# Altium schematic sheet S1_Interface.SchDoc
size A3; SheetNumber: 1; SheetTotal: 2
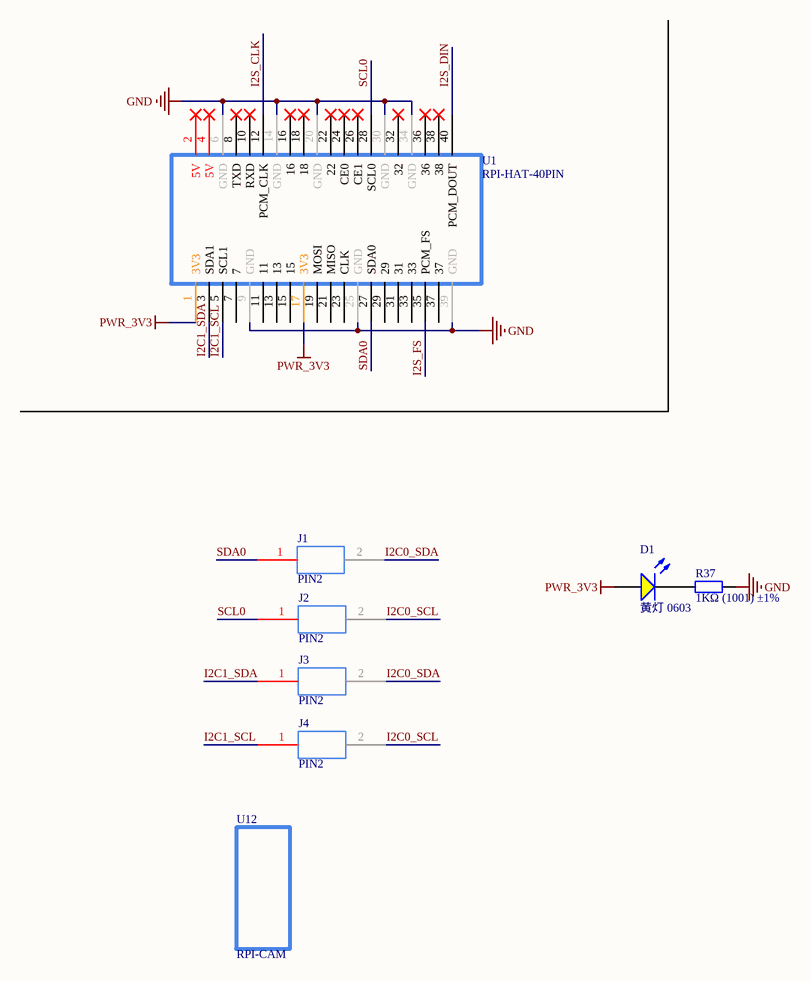
[diagram p0: S1_Interface.SchDoc]

## Parts
D1  黄灯 0603  [0603_LED_S1]
J1  PIN2  [PIN2]
J2  PIN2  [PIN2]
J3  PIN2  [PIN2]
J4  PIN2  [PIN2]
R37  1KΩ (1001) ±1%  [0603_R]
U1  RPI-HAT-40PIN  [RPI-HAT-40PIN]
U12  RPI-CAM  [RPI-CAM]

## Nets
GND: R37.2 U1.6(GND) U1.9(GND) U1.14(GND) U1.20(GND) U1.25(GND) U1.30(GND) U1.34(GND) U1.39(GND)
PWR_3V3: D1.A U1.1(3V3) U1.17(3V3)
I2C0_SCL: J2.2(GND) J4.2(GND)
I2C0_SDA: J1.2(GND) J3.2(GND)
I2C1_SCL: J4.1(VCC) U1.5(SCL1)
I2C1_SDA: J3.1(VCC) U1.3(SDA1)
I2S_CLK: U1.12(PCM_CLK)
I2S_DIN: U1.40(PCM_DOUT)
I2S_FS: U1.35(PCM_FS)
SCL0: J2.1(VCC) U1.28(SCL0)
SDA0: J1.1(VCC) U1.27(SDA0)
NetD1_K: D1.K R37.1

Not connected (* = marked no-connect by the designer): U1 2(5V)* 4(5V)* 7 8(TXD)* 10(RXD)* 11 13 15 16* 18* 19(MOSI) 21(MISO) 22* 23(CLK) 24(CE0)* 26(CE1)* 29 31 32* 33 36* 37 38*

## Library data of the parts
D1 = 0603 黄灯: 发光二极管; ComponentLink1Description: 供应商链接; ComponentLink1URL: http://www.szlcsc.com/product/details_73147.html; Package: 0603; Supplier: LC; SuppliersPartNumber: C72038
R37 = 0603 1KΩ (1001) 1%: 贴片电阻; ComponentLink1Description: 供应商链接; ComponentLink1URL: http://www.szlcsc.com/product/details_21904.html; Package: 0603; Supplier: LC; SuppliersPartNumber: C21190